# Altium schematic sheet Sheet1.SchDoc
size A4; SheetNumber: 1; SheetTotal: 1
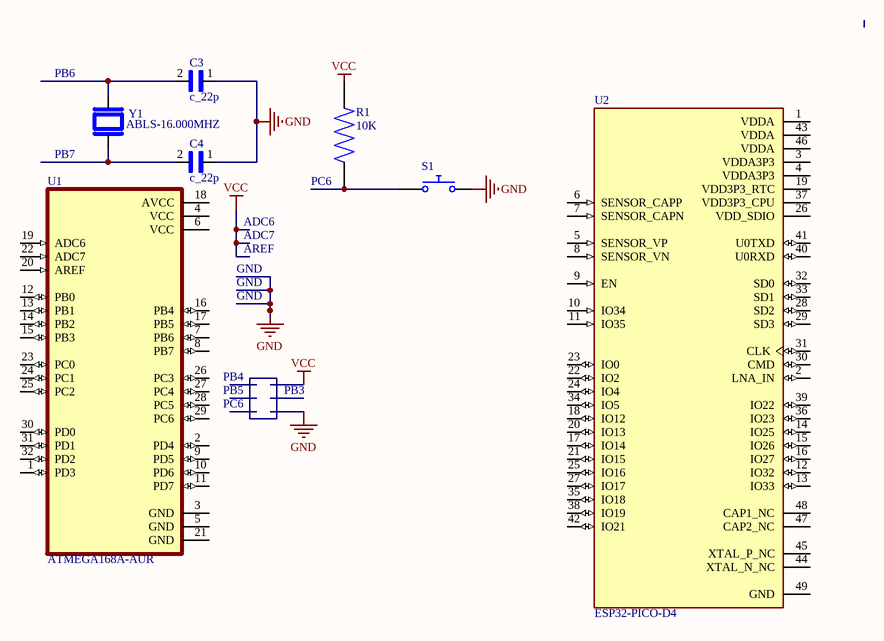
[diagram p0: Sheet1.SchDoc]

## Parts
C3  c_22p  [CAPC2012X145N]
C4  c_22p  [CAPC2012X145N]
R1  10K  [RESC1508X55N]
S1  Push Button Normally Opened  (value not drawn)
U1  ATMEGA168A-AUR  [QFP80P900X900X120-32N]
U2  ESP32-PICO-D4  [PQFN50P700X700X104-49N]
Y1  ABLS-16.000MHZ  [XTAL_ABLS-16.000MHZ-20-L-4-Q-T]

## Nets
GND: C3.1 C4.1
NetC3_2: C3.2 Y1.2
NetC4_2: C4.2 Y1.1
NetR1_1: R1.1 S1.1

Not connected (* = marked no-connect by the designer): R1 2; S1 2; U1 1(PD3) 2(PD4) 3(GND) 4(VCC) 5(GND) 6(VCC) 7(PB6) 8(PB7) 9(PD5) 10(PD6) 11(PD7) 12(PB0) 13(PB1) 14(PB2) 15(PB3) 16(PB4) 17(PB5) 18(AVCC) 19(ADC6) 20(AREF) 21(GND) 22(ADC7) 23(PC0) 24(PC1) 25(PC2) 26(PC3) 27(PC4) 28(PC5) 29(PC6) 30(PD0) 31(PD1) 32(PD2); U2 1(VDDA) 2(LNA_IN) 3(VDDA3P3) 4(VDDA3P3) 5(SENSOR_VP) 6(SENSOR_CAPP) 7(SENSOR_CAPN) 8(SENSOR_VN) 9(EN) 10(IO34) 11(IO35) 12(IO32) 13(IO33) 14(IO25) 15(IO26) 16(IO27) 17(IO14) 18(IO12) 19(VDD3P3_RTC) 20(IO13) 21(IO15) 22(IO2) 23(IO0) 24(IO4) 25(IO16) 26(VDD_SDIO) 27(IO17) 28(SD2) 29(SD3) 30(CMD) 31(CLK) 32(SD0) 33(SD1) 34(IO5) 35(IO18) 36(IO23) 37(VDD3P3_CPU) 38(IO19) 39(IO22) 40(U0RXD) 41(U0TXD) 42(IO21) 43(VDDA) 44(XTAL_N_NC) 45(XTAL_P_NC) 46(VDDA) 47(CAP2_NC) 48(CAP1_NC) 49(GND)

## Notes on the sheet
- (near Y1) PB6
- PB7
- (near R1) PC6
- ADC6
- ADC7
- AREF
- GND
- (near U1) PB4
- (near U1) PB5
- PB3
- (near U1) PC6
- Labels drawn without touching a wire or pin: GND, VCC

## Library data of the parts
C3 C4 = C2012X5R1A226K125AB: 22ÂµF Â±10% 10V Ceramic Capacitor X5R 0805 (2012 Metric); MF: TDK; MP: C2012X5R1A226K125AB; Purchase-URL: https://pricing.snapeda.com/search/part/C2012X5R1A226K125AB/?ref=eda; Availability: In Stock; SnapEDA_Link: https://www.snapeda.com/parts/C2012X5R1A226K125AB/TDK-Lambda+Americas+Inc/view-part/?ref=snap; Package: 2012 TDK; Value: *; Check_prices: https://www.snapeda.com/parts/C2012X5R1A226K125AB/TDK-Lambda+Americas+Inc/view-part/?ref=eda; Price: None
R1 = RMCF0603JT10K0: Package: None; Price: None; Value: *; MP: RMCF0603JT10K0; Availability: Unavailable
S1 = Push Button NO: closed: 0; Rclosed: 1m; Ropen: 1Meg; SimulationGenericComponent: True
U1 = ATMEGA168A-AUR: AVR AVRÂ® ATmega å¾®æŽ§åˆ¶å™¨ IC 8 ä½ 20MHz 16KB (8K x 16) é–ƒå­˜ 32-TQFP (7x7); MF: Microchip; SnapEDA_Link: https://www.snapeda.com/parts/ATMEGA168A-AUR/Microchip/view-part/?ref=snap; MP: ATMEGA168A-AUR; Check_prices: https://www.snapeda.com/parts/ATMEGA168A-AUR/Microchip/view-part/?ref=eda; Purchase-URL: https://pricing.snapeda.com/search/part/ATMEGA168A-AUR/?ref=eda; Digi-Key_Part_Number: ATMEGA168A-AURTR-ND; Value: *; Package: TQFP-32 Microchip
U2 = ESP32-PICO-D4: Bluetooth, WiFi 802.11b/g/n, Bluetooth v4.2 +EDR, Class 1, 2 and 3 Transceiver Module 2.4GHz ~ 2.5GHz Surface Mount; Value: *; Availability: Unavailable; Price: None; MP: ESP32-PICO-D4; Package: None
Y1 = ABLS-16.000MHZ-20-L-4-Q-T: Crystal 16MHz Â±30ppm (Tol) Â±100ppm (Stability) 20pF FUND 40Ohm 2-Pin HC-49/US SMD T/R; MF: Abracon Corporation; Check_prices: https://www.snapeda.com/parts/ABLS-16.000MHZ-20-L-4-Q-T/Abracon/view-part/?ref=eda; Value: *; SnapEDA_Link: https://www.snapeda.com/parts/ABLS-16.000MHZ-20-L-4-Q-T/Abracon/view-part/?ref=snap; Availability: In Stock; Package: None; Purchase-URL: https://pricing.snapeda.com/search/part/ABLS-16.000MHZ-20-L-4-Q-T/?ref=eda; Price: None; MP: ABLS-16.000MHZ-20-L-4-Q-T